# Altium project RobotShield.PrjPcb
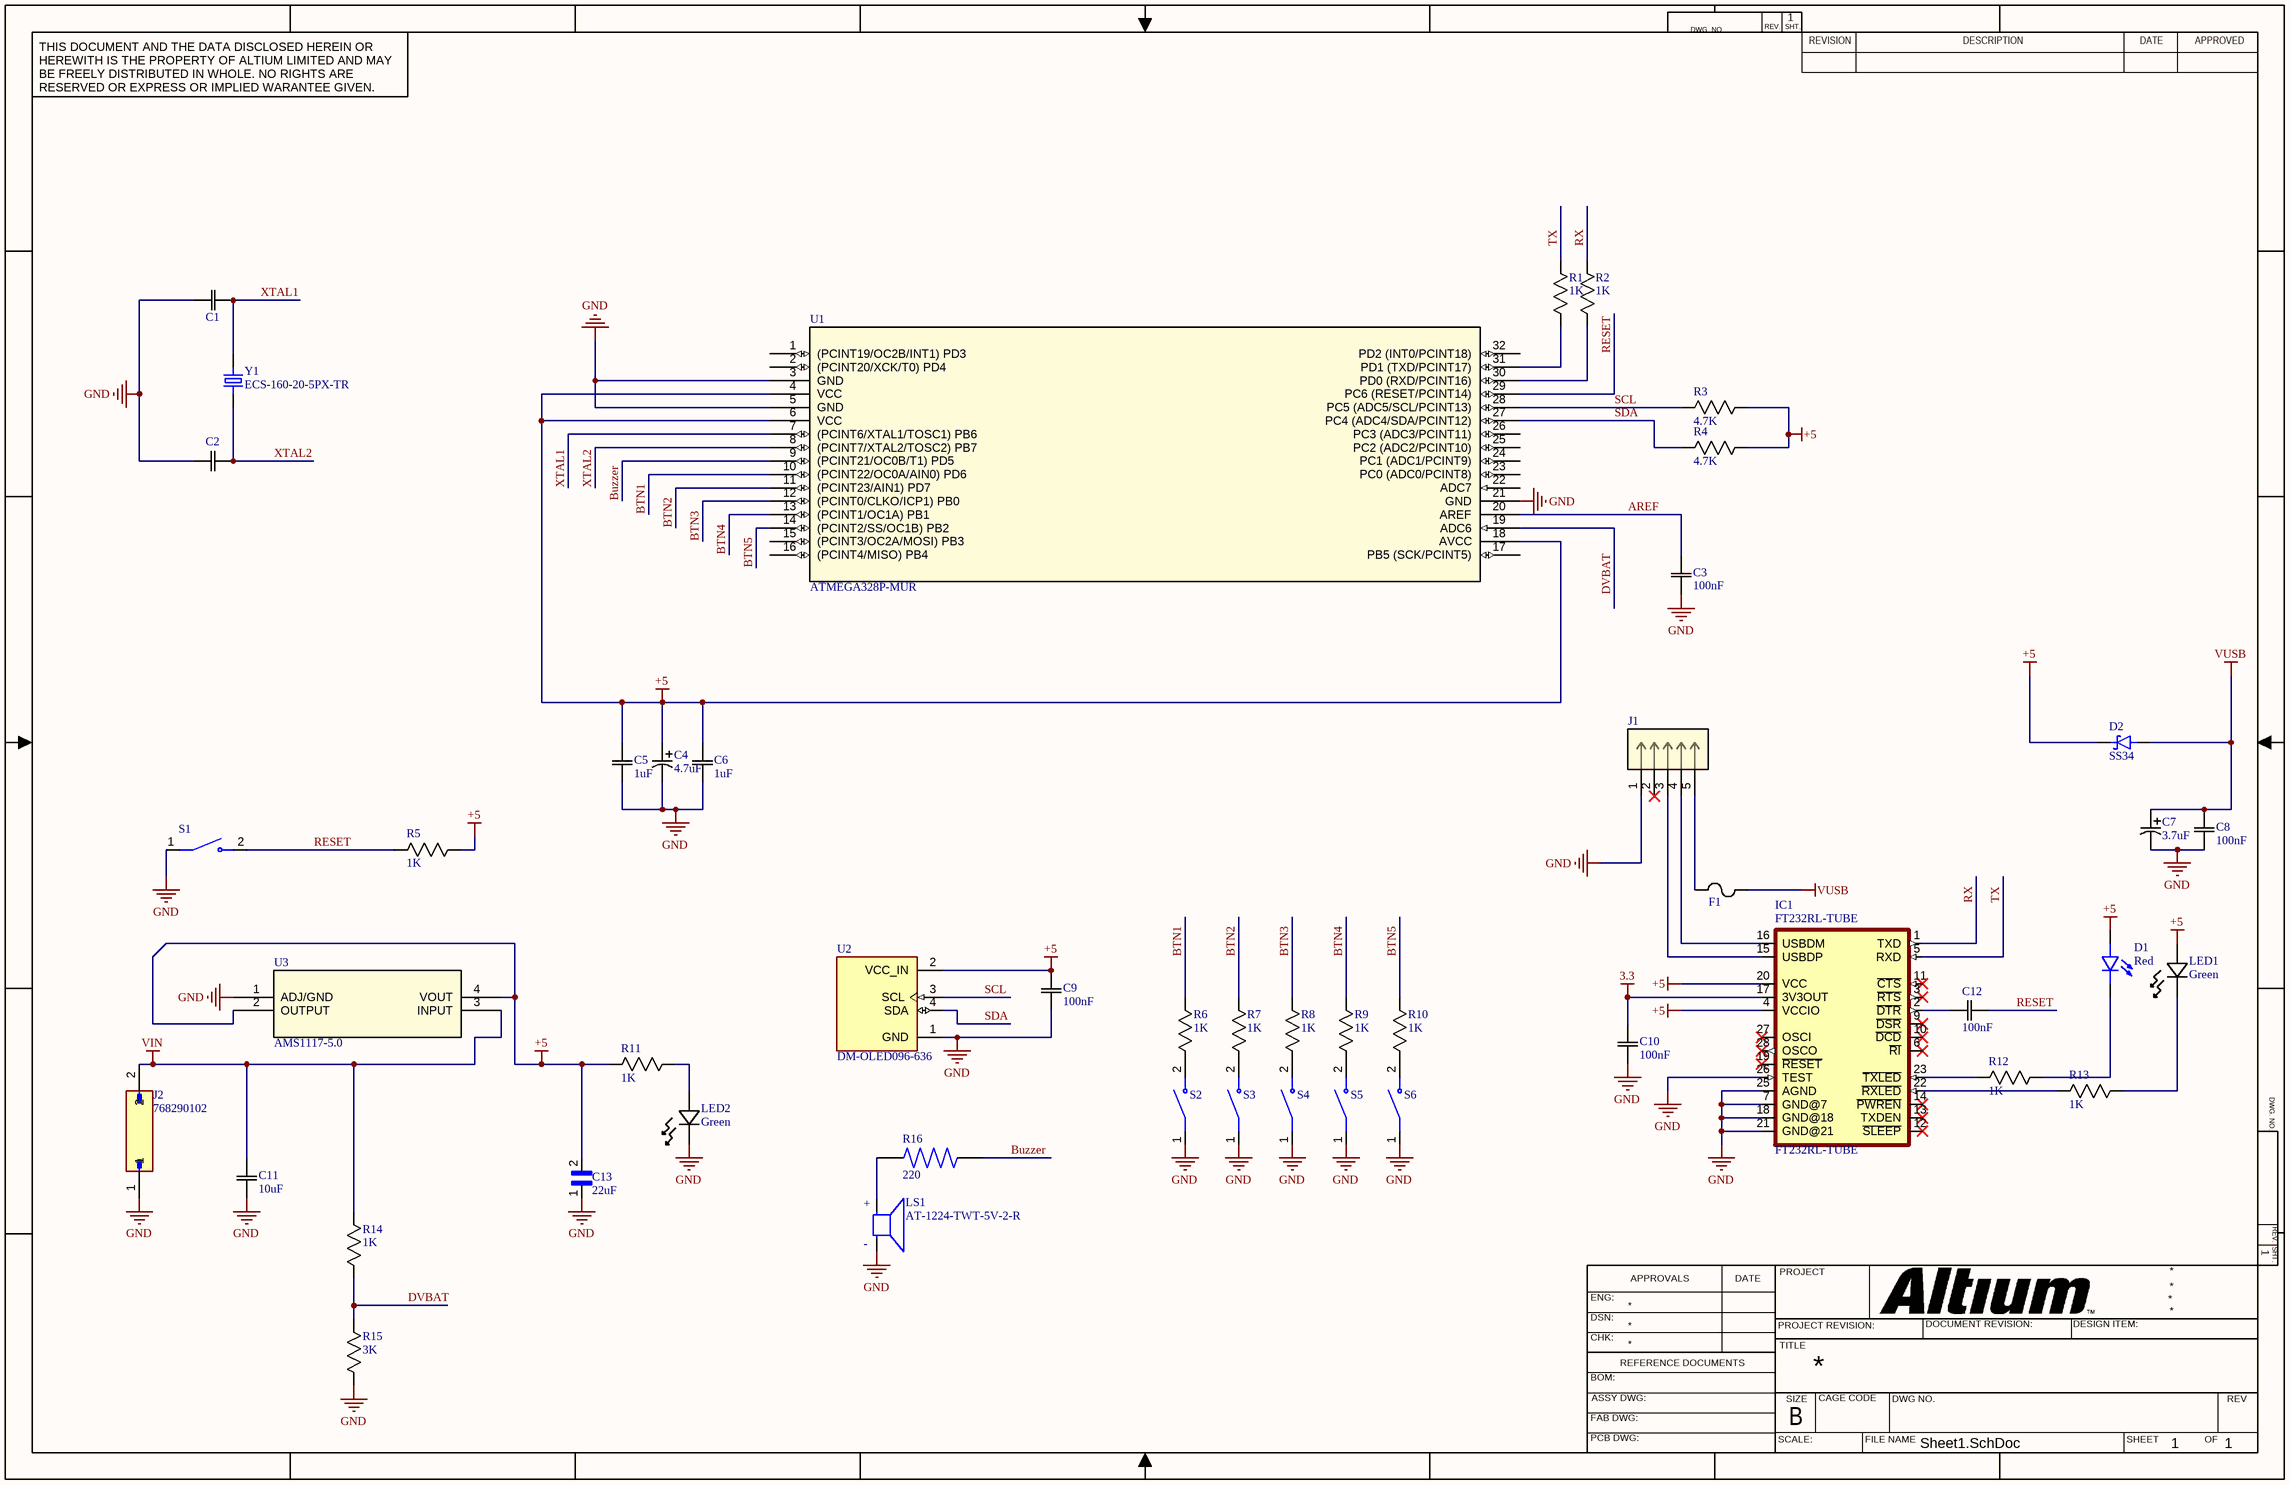
[diagram p0: Sheet1.SchDoc]
1 sheet, 48 parts. Net scope: global (net labels, ports and power ports of the same name join across sheets).
Board file: PCB1.PcbDoc

## Sheet Sheet1.SchDoc
size 431 x 279 mm; SheetNumber: 1; SheetTotal: 1

### Parts
C1  CAP_18pfar_805pkg  [CAP_CC0805_YAG]  (value not drawn)
C2  CAP_18pfar_805pkg  [CAP_CC0805_YAG]  (value not drawn)
C3  100nF  [CC0805N_YAG]
C4  4.7uF  [CAP_PAN_EEE_B_PAN]
C5  1uF  [CAP_CL21B105KAFNNNE_SAM]
C6  1uF  [CAP_CL21B105KAFNNNE_SAM]
C7  3.7uF  [CAP_PAN_EEE_B_PAN]
C8  100nF  [CC0805N_YAG]
C9  100nF  [CC0805N_YAG]
C10  100nF  [CC0805N_YAG]
C11  10uF  [CAP_CL21_SAM]
C12  100nF  [CC0805N_YAG]
C13  22uF  [CAPC3225X280N]
D1  Red  [LED_150060RS75000]
D2  SS34  [DIOM7959X265N]
F1  MF-FSMF050X-2  [FUSE_MF-FSMF050X_BRN]  (value not drawn)
IC1  FT232RL-TUBE  [SSOP28-LD]
J1  1734327-2  [CONN_1734327-2_TEC]  (value not drawn)
J2  768290102  [MOLEX_768290102]
LED1  Green  [LED_150060GS75000_WRE]
LED2  Green  [LED_150060GS75000_WRE]
LS1  AT-1224-TWT-5V-2-R  [XDCR_AT-1224-TWT-5V-2-R]
R1  1K  [RC0805N_YAG]
R2  1K  [RC0805N_YAG]
R3  4.7K  [RES_CRCW_0805_VIS]
R4  4.7K  [RES_CRCW_0805_VIS]
R5  1K  [RC0805N_YAG]
R6  1K  [RC0805N_YAG]
R7  1K  [RC0805N_YAG]
R8  1K  [RC0805N_YAG]
R9  1K  [RC0805N_YAG]
R10  1K  [RC0805N_YAG]
R11  1K  [RC0805N_YAG]
R12  1K  [RC0805N_YAG]
R13  1K  [RC0805N_YAG]
R14  1K  [RC0805N_YAG]
R15  3K  [RES_CRG0805_TEC]
R16  220  [RESC2012X65N]
S1  PTS636_SM43J_SMTR_LFS  [SW_PTS636_SM43J_SMTR_LFS]  (value not drawn)
S2  PTS636_SM43J_SMTR_LFS  [SW_PTS636_SM43J_SMTR_LFS]  (value not drawn)
S3  PTS636_SM43J_SMTR_LFS  [SW_PTS636_SM43J_SMTR_LFS]  (value not drawn)
S4  PTS636_SM43J_SMTR_LFS  [SW_PTS636_SM43J_SMTR_LFS]  (value not drawn)
S5  PTS636_SM43J_SMTR_LFS  [SW_PTS636_SM43J_SMTR_LFS]  (value not drawn)
S6  PTS636_SM43J_SMTR_LFS  [SW_PTS636_SM43J_SMTR_LFS]  (value not drawn)
U1  ATMEGA328P-MUR  [32M1-A_ATM]
U2  DM-OLED096-636  [MODULE_DM-OLED096-636]
U3  AMS1117-5.0  [SOT_AMS1117-2.5_AMS]
Y1  ECS-160-20-5PX-TR  [XTAL_ECS-160-20-5PX-TR]

### Nets
3.3: C10.2 IC1.17(3V3OUT)
+5: C4.1 C5.2 C6.2 C9.2 C13.2 D1.2(A) D2.C(K) IC1.4(VCCIO) IC1.20(VCC) LED1.2 R3.2 R4.2 R5.1 R11.2 U1.4(VCC) U1.6(VCC) U1.18(AVCC) U2.2(VCC_IN) U3.2(OUTPUT) U3.4(VOUT)
GND: C1.2 C2.1 C3.1 C4.2 C5.1 C6.1 C7.2 C8.1 C9.1 C10.1 C11.1 C13.1 IC1.7(GND@7) IC1.18(GND@18) IC1.21(GND@21) IC1.25(AGND) IC1.26(TEST) J1.1 J2.1 LED2.1 LS1.N R15.1 S1.1(COM) S2.1(COM) S3.1(COM) S4.1(COM) S5.1(COM) S6.1(COM) U1.3(GND) U1.5(GND) U1.21(GND) U2.1(GND) U3.1(ADJ/GND)
VIN: C11.2 J2.2 R14.1 U3.3(INPUT)
VUSB: C7.1 C8.2 D2.A F1.2
AREF: C3.2 U1.20(AREF)
BTN1: R6.1 U1.10((PCINT22/OC0A/AIN0)_PD6)
BTN2: R7.1 U1.11((PCINT23/AIN1)_PD7)
BTN3: R8.1 U1.12((PCINT0/CLKO/ICP1)_PB0)
BTN4: R9.1 U1.13((PCINT1/OC1A)_PB1)
BTN5: R10.1 U1.14((PCINT2/SS/OC1B)_PB2)
Buzzer: R16.2 U1.9((PCINT21/OC0B/T1)_PD5)
DVBAT: R14.2 R15.2 U1.19(ADC6)
RESET: C12.1 R5.2 S1.2(NO) U1.29(PC6_(RESET/PCINT14))
RX: IC1.1(TXD) R2.1
SCL: R3.1 U1.28(PC5_(ADC5/SCL/PCINT13)) U2.3(SCL)
SDA: R4.1 U1.27(PC4_(ADC4/SDA/PCINT12)) U2.4(SDA)
TX: IC1.5(RXD) R1.1
XTAL1: C1.1 U1.7((PCINT6/XTAL1/TOSC1)_PB6) Y1.2
XTAL2: C2.2 U1.8((PCINT7/XTAL2/TOSC2)_PB7) Y1.1
NetC12_2: C12.2 IC1.2(~{DTR})
NetD1_1: D1.1(C) R12.1
NetF1_1: F1.1 J1.5
NetIC1_15: IC1.15(USBDP) J1.3
NetIC1_16: IC1.16(USBDM) J1.4
NetIC1_22: IC1.22(~{RXLED}) R13.2
NetIC1_23: IC1.23(~{TXLED}) R12.2
NetLED1_1: LED1.1 R13.1
NetLED2_2: LED2.2 R11.1
NetLS1_P: LS1.P R16.1
NetR1_2: R1.2 U1.31(PD1_(TXD/PCINT17))
NetR2_2: R2.2 U1.30(PD0_(RXD/PCINT16))
NetR6_2: R6.2 S2.2(NO)
NetR7_2: R7.2 S3.2(NO)
NetR8_2: R8.2 S4.2(NO)
NetR9_2: R9.2 S5.2(NO)
NetR10_2: R10.2 S6.2(NO)

Not connected (* = marked no-connect by the designer): IC1 3(~{RTS})* 6(~{RI})* 9(~{DSR})* 10(~{DCD})* 11(~{CTS})* 12(~{SLEEP})* 13(TXDEN)* 14(~{PWREN})* 19(~{RESET})* 27(OSCI)* 28(OSCO)*; J1 2*; U1 1((PCINT19/OC2B/INT1)_PD3) 2((PCINT20/XCK/T0)_PD4) 15((PCINT3/OC2A/MOSI)_PB3) 16((PCINT4/MISO)_PB4) 17(PB5_(SCK/PCINT5)) 22(ADC7) 23(PC0_(ADC0/PCINT8)) 24(PC1_(ADC1/PCINT9)) 25(PC2_(ADC2/PCINT10)) 26(PC3_(ADC3/PCINT11)) 32(PD2_(INT0/PCINT18))

### Notes on the sheet
- DWG. NO.
- REV.
- SHT.
- THIS DOCUMENT AND THE DATA DISCLOSED HEREIN OR HEREWITH IS THE PROPERTY OF ALTIUM LIMITED AND MAY BE FREELY DISTRIBUTED IN WHOLE. NO RIGHTS ARE RESERVED OR EXPRESS OR IMPLIED WARANTEE GIVEN.
- REVISION
- DESCRIPTION
- DATE
- APPROVED
- ENG:
- APPROVALS
- PROJECT
- DSN:
- CHK:
- REFERENCE DOCUMENTS
- PROJECT REVISION:
- TITLE
- DOCUMENT REVISION:
- DESIGN ITEM:
- BOM:
- FAB DWG:
- PCB DWG:
- ASSY DWG:
- SCALE:
- SIZE
- B
- CAGE CODE
- FILE NAME
- DWG NO.
- SHEET
- OF
- REV
- (in symbol AT-1224-TWT-5V-2-R) +; -

### Library data of the parts
C1 C2 = CAP_18pfar_805pkg: No Description Available; Mfr_Name: Yageo
C3 C8-C10 C12 = CC0805KRX7R9BB104: No Description Available; Mfr_Name: Yageo
C4 C7 = EEE-HA1E4R7R: No Description Available; Mfr_Name: Panasonic
C5 C6 = CL21B105KAFNNNE: No Description Available; Mfr_Name: Samsung
C11 = CAP_10ufar_805pkg: No Description Available; Mfr_Name: Samsung
C13 = GCJ32ER71C226KE01L: SMD Capacitor X7R_EIA_ with Capacitance: 22uF Tol. 10%. Rated Voltage: 16Vdc; MF: Murata; Price: None; Availability: Unavailable; MP: GCJ32ER71C226KE01L; Package: 3225 Murata; SnapEDA_Link: https://www.snapeda.com/parts/GCJ32ER71C226KE01L/Murata/view-part/4383175/?ref=snap; Value: *
D1 = 150060RS75000: Availability: Unavailable; Price: None; Value: *; MP: 150060RS75000; Package: None
D2 = SS34: Diode Schottky 40 V 3A Surface Mount SMC (DO-214AB); MF: onsemi; SnapEDA_Link: https://www.snapeda.com/parts/SS34/Onsemi/view-part/?ref=snap; Package: SMC-2 ON Semiconductor; Value: *; MP: SS34; Check_prices: https://www.snapeda.com/parts/SS34/Onsemi/view-part/?ref=eda
F1 = MF-FSMF050X-2: No Description Available; Mfr_Name: Bourns Electronics
IC1 = FT232RL-TUBE: USB Bridge, USB to UART USB 2.0 UART Interface 28-SSOP; MF: FTDI,; Package: SSOP-28 FTDI; MP: FT232RL-TUBE; SnapEDA_Link: https://www.snapeda.com/parts/FT232RL-TUBE/FTDI%252C+Future+Technology+Devices+International+Ltd/view-part/?ref=snap; Purchase-URL: https://pricing.snapeda.com/search/part/FT232RL-TUBE/?ref=eda; Check_prices: https://www.snapeda.com/parts/FT232RL-TUBE/FTDI%252C+Future+Technology+Devices+International+Ltd/view-part/?ref=eda; Value: *; Digi-Key_Part_Number: 768-1306-ND
J1 = 1734327-2: No Description Available; Mfr_Name: TE Connectivity; Type: USB, DVI, HDMI, Connectors; RefDes: RefDes
LED1 LED2 = 150060GS75000: No Description Available; Mfr_Name: Wurth Electronics
LS1 = AT-1224-TWT-5V-2-R: AUDIO TRANSDUCER 12 VP-P 85 DB 2400 HZ; Package: None; Price: None; Value: *; MP: AT-1224-TWT-5V-2-R; Availability: Unavailable
R1 R2 R5-R14 = RC0805FR-071KL: No Description Available; Mfr_Name: Yageo
R3 R4 = CRCW08054K70FKEAC: No Description Available; Mfr_Name: Vishay
R15 = CRG0805F3K0: No Description Available; Mfr_Name: TE Connectivity
R16 = CRGCQ0805F220R: Fixed Resistor CRGCQ 0805 220R 1%; MF: TE Connectivity; SnapEDA_Link: https://www.snapeda.com/parts/CRGCQ0805F220R/TE%20Connectivity%20Passive%20Product/view-part/3188284/?ref=snap; Mouser-Purchase-URL: https://snapeda.com/shop?store=Mouser&id=3188284; Digi-Key_Part_Number: A129741CT-ND; DigiKey-Purchase-URL: https://snapeda.com/shop?store=DigiKey&id=3188284; Package: 2012 TE Connectivity; Value: *; MP: CRGCQ0805F220R
S1-S6 = PTS636_SM43J_SMTR_LFS: Tactile Switch SPST-NO Top Actuated Surface Mount; Price: None; Value: *; MP: PTS636_SM43J_SMTR_LFS; Package: None; Availability: Unavailable
U1 = ATMEGA328P-MUR: No Description Available; Mfr_Name: Microchip; RefDes: RefDes; Type: Type
U2 = DM-OLED096-636: 0.96â€ 128 X 64 MONOCHROME GRAPHIC OLED DISPLAY MODULE - I2C; SnapEDA_Link: https://www.snapeda.com/parts/DM-OLED096-636/Display+Module/view-part/?ref=snap; Package: Package; Value: *; MF: Display Module; MP: DM-OLED096-636; Check_prices: https://www.snapeda.com/parts/DM-OLED096-636/Display+Module/view-part/?ref=eda
U3 = AMS1117-5.0: No Description Available; Mfr_Name: ams OSRAM; RefDes: RefDes; Type: Type
Y1 = ECS-160-20-5PX-TR: 16MHz Â±30ppm Crystal 20pF 40 Ohms HC-49/US; MF: ECS Inc.; SnapEDA_Link: https://www.snapeda.com/parts/ECS-160-20-5PX-TR/ECS%20Inc./view-part/554223/?ref=snap; Availability: Unavailable; MP: ECS-160-20-5PX-TR; Value: *; Price: None; Package: HC49/US ECS International
J2 = 768290102: Price: None; Value: *; Package: None; Availability: Unavailable; MP: 768290102